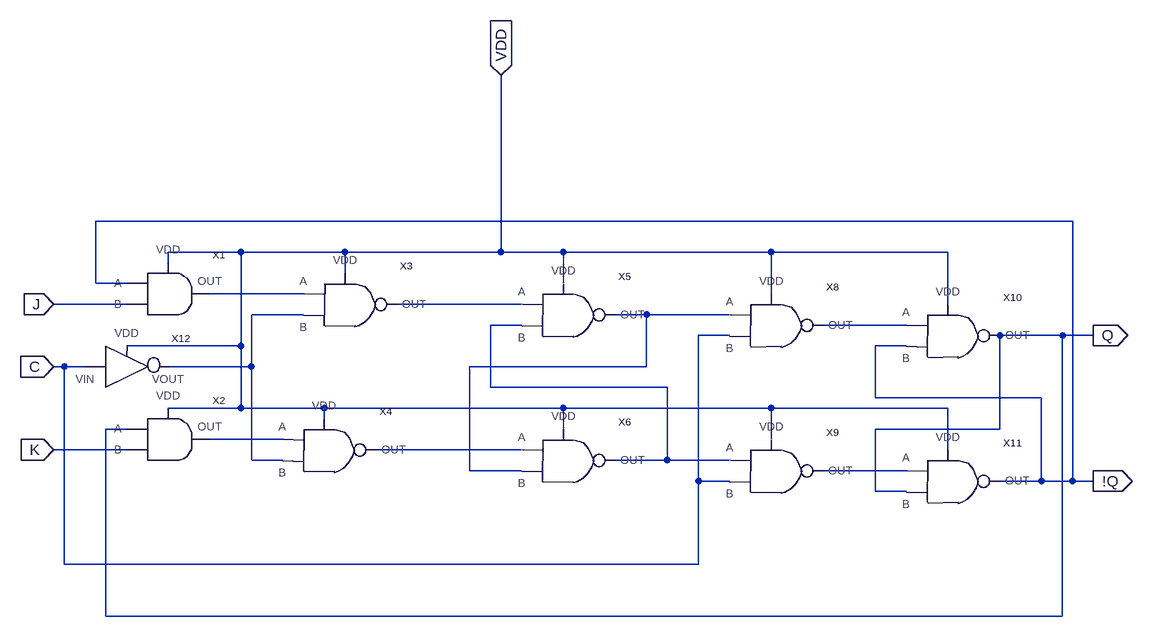
[diagram p0: schematic jk-front.asc]
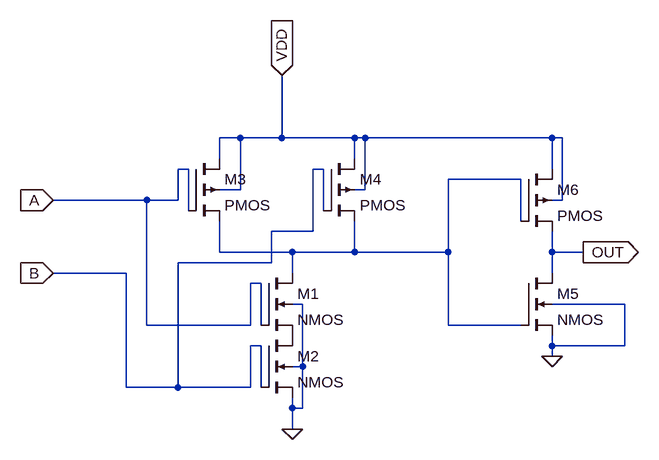
[diagram p1: sub-circuit and.asc]
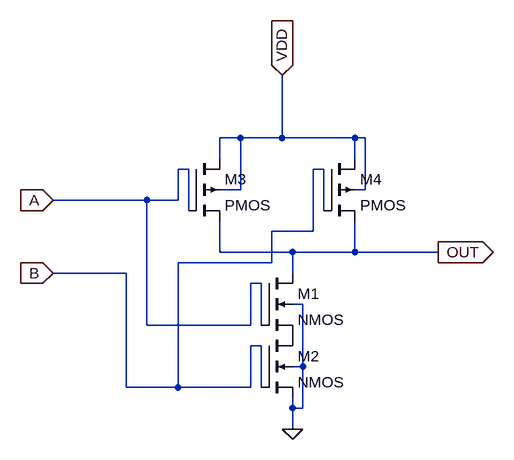
[diagram p2: sub-circuit nand.asc]
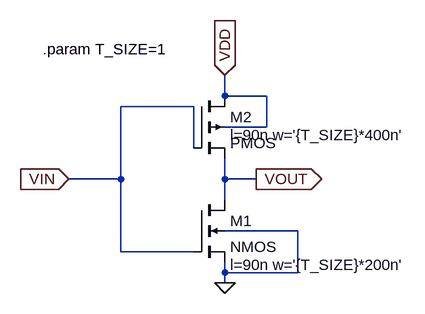
[diagram p3: sub-circuit inverter.asc]
jk-front.asc, the LTspice schematic file:
Version 4
SHEET 1 1588 680
WIRE 1472 -48 -32 -48
WIRE 192 0 80 0
WIRE 352 0 192 0
WIRE 592 0 592 -272
WIRE 592 0 352 0
WIRE 688 0 592 0
WIRE 1008 0 688 0
WIRE 1280 0 1008 0
WIRE 80 16 80 0
WIRE 352 32 352 0
WIRE -32 48 -32 -48
WIRE 16 48 -32 48
WIRE 688 48 688 0
WIRE 288 64 144 64
WIRE 1008 64 1008 0
WIRE 16 80 -96 80
WIRE 624 80 432 80
WIRE 1280 80 1280 0
WIRE 288 96 208 96
WIRE 816 96 768 96
WIRE 944 96 816 96
WIRE 624 112 576 112
WIRE 1216 112 1088 112
WIRE 944 128 896 128
WIRE 1456 128 1360 128
WIRE 1504 128 1456 128
WIRE 192 144 192 0
WIRE 192 144 16 144
WIRE 1216 144 1168 144
WIRE -80 176 -96 176
WIRE -48 176 -80 176
WIRE 208 176 208 96
WIRE 208 176 80 176
WIRE 816 176 816 96
WIRE 816 176 544 176
WIRE 576 208 576 112
WIRE 848 208 576 208
WIRE 1168 224 1168 144
WIRE 1424 224 1168 224
WIRE 192 240 192 144
WIRE 192 240 80 240
WIRE 320 240 192 240
WIRE 688 240 320 240
WIRE 1008 240 688 240
WIRE 1280 240 1008 240
WIRE 320 256 320 240
WIRE 16 272 -16 272
WIRE 688 272 688 240
WIRE 1360 272 1360 128
WIRE 1360 272 1168 272
WIRE 256 288 144 288
WIRE 1008 288 1008 240
WIRE 16 304 -96 304
WIRE 624 304 400 304
WIRE 1280 304 1280 240
WIRE 208 320 208 176
WIRE 256 320 208 320
WIRE 848 320 848 208
WIRE 848 320 768 320
WIRE 944 320 848 320
WIRE 544 336 544 176
WIRE 624 336 544 336
WIRE 1216 336 1088 336
WIRE 896 352 896 128
WIRE 944 352 896 352
WIRE 1424 352 1424 224
WIRE 1424 352 1360 352
WIRE 1472 352 1472 -48
WIRE 1472 352 1424 352
WIRE 1504 352 1472 352
WIRE 1168 368 1168 272
WIRE 1216 368 1168 368
WIRE -80 480 -80 176
WIRE 896 480 896 352
WIRE 896 480 -80 480
WIRE -16 560 -16 272
WIRE 1456 560 1456 128
WIRE 1456 560 -16 560
FLAG -96 80 J
IOPIN -96 80 In
FLAG -96 176 C
IOPIN -96 176 In
FLAG -96 304 K
IOPIN -96 304 In
FLAG 1504 128 Q
IOPIN 1504 128 Out
FLAG 1504 352 !Q
IOPIN 1504 352 Out
FLAG 592 -272 VDD
IOPIN 592 -272 In
SYMBOL and 64 64 R0
SYMATTR InstName X1
SYMBOL and 64 288 R0
SYMATTR InstName X2
SYMBOL nand 352 80 R0
SYMATTR InstName X3
SYMBOL nand 320 304 R0
SYMATTR InstName X4
SYMBOL nand 688 96 R0
SYMATTR InstName X5
SYMBOL nand 688 320 R0
SYMATTR InstName X6
SYMBOL nand 1008 112 R0
SYMATTR InstName X8
SYMBOL nand 1008 336 R0
SYMATTR InstName X9
SYMBOL nand 1280 128 R0
SYMATTR InstName X10
SYMBOL nand 1280 352 R0
SYMATTR InstName X11
SYMBOL inverter 16 176 R0
SYMATTR InstName X12

and.asc, the sub-circuit schematic file:
Version 4
SHEET 1 1116 788
WIRE 112 -32 80 -32
WIRE 176 -32 176 -128
WIRE 176 -32 112 -32
WIRE 288 -32 176 -32
WIRE 304 -32 288 -32
WIRE 592 -32 304 -32
WIRE 608 -32 592 -32
WIRE 80 0 80 -32
WIRE 288 0 288 -32
WIRE 32 16 16 16
WIRE 240 16 224 16
WIRE 592 16 592 -32
WIRE 544 32 432 32
WIRE 112 48 112 -32
WIRE 112 48 80 48
WIRE 304 48 304 -32
WIRE 304 48 288 48
WIRE -32 64 -176 64
WIRE 16 64 16 16
WIRE 16 64 -32 64
WIRE 608 64 608 -32
WIRE 608 64 592 64
WIRE 32 80 32 16
WIRE 240 80 240 16
WIRE 544 96 544 32
WIRE 224 112 224 16
WIRE 224 112 160 112
WIRE 80 144 80 96
WIRE 192 144 80 144
WIRE 288 144 288 96
WIRE 288 144 192 144
WIRE 432 144 432 32
WIRE 432 144 288 144
WIRE 592 144 592 112
WIRE 640 144 592 144
WIRE 160 160 160 112
WIRE 160 160 16 160
WIRE -64 176 -176 176
WIRE 192 176 192 144
WIRE 592 176 592 144
WIRE 144 192 128 192
WIRE 208 224 192 224
WIRE 704 224 592 224
WIRE -32 256 -32 64
WIRE 128 256 128 192
WIRE 128 256 -32 256
WIRE 144 256 144 192
WIRE 432 256 432 144
WIRE 544 256 432 256
WIRE 144 288 128 288
WIRE 592 288 592 272
WIRE 704 288 704 224
WIRE 704 288 592 288
WIRE 592 304 592 288
WIRE 208 320 208 224
WIRE 208 320 192 320
WIRE -64 352 -64 176
WIRE 16 352 16 160
WIRE 16 352 -64 352
WIRE 128 352 128 288
WIRE 128 352 16 352
WIRE 144 352 144 288
WIRE 192 384 192 368
WIRE 208 384 208 320
WIRE 208 384 192 384
WIRE 192 416 192 384
FLAG 192 416 0
FLAG -176 64 A
IOPIN -176 64 In
FLAG -176 176 B
IOPIN -176 176 In
FLAG 176 -128 VDD
IOPIN 176 -128 In
FLAG 592 304 0
FLAG 640 144 OUT
IOPIN 640 144 Out
SYMBOL nmos4 144 176 R0
SYMATTR InstName M1
SYMATTR Value2 l=90n w=200n
SYMBOL nmos4 144 272 R0
SYMATTR InstName M2
SYMATTR Value2 l=90n w=200n
SYMBOL pmos4 32 0 R0
SYMATTR InstName M3
SYMATTR Value2 l=90n w=400n
SYMBOL pmos4 240 0 R0
SYMATTR InstName M4
SYMATTR Value2 l=90n w=400n
SYMBOL nmos4 544 176 R0
SYMATTR Value2 l=90n w=200n
SYMATTR InstName M5
SYMBOL pmos4 544 16 R0
SYMATTR Value2 l=90n w=400n
SYMATTR InstName M6

nand.asc, the sub-circuit schematic file:
Version 4
SHEET 1 880 680
WIRE 144 -80 112 -80
WIRE 208 -80 208 -176
WIRE 208 -80 144 -80
WIRE 320 -80 208 -80
WIRE 336 -80 320 -80
WIRE 112 -48 112 -80
WIRE 320 -48 320 -80
WIRE 64 -32 48 -32
WIRE 272 -32 256 -32
WIRE 144 0 144 -80
WIRE 144 0 112 0
WIRE 336 0 336 -80
WIRE 336 0 320 0
WIRE 0 16 -144 16
WIRE 48 16 48 -32
WIRE 48 16 0 16
WIRE 64 32 64 -32
WIRE 272 32 272 -32
WIRE 256 64 256 -32
WIRE 256 64 192 64
WIRE 112 96 112 48
WIRE 224 96 112 96
WIRE 320 96 320 48
WIRE 320 96 224 96
WIRE 448 96 320 96
WIRE 192 112 192 64
WIRE 192 112 48 112
WIRE -32 128 -144 128
WIRE 224 128 224 96
WIRE 176 144 160 144
WIRE 240 176 224 176
WIRE 0 208 0 16
WIRE 160 208 160 144
WIRE 160 208 0 208
WIRE 176 208 176 144
WIRE 176 240 160 240
WIRE 240 272 240 176
WIRE 240 272 224 272
WIRE -32 304 -32 128
WIRE 48 304 48 112
WIRE 48 304 -32 304
WIRE 160 304 160 240
WIRE 160 304 48 304
WIRE 176 304 176 240
WIRE 224 336 224 320
WIRE 240 336 240 272
WIRE 240 336 224 336
WIRE 224 368 224 336
FLAG 224 368 0
FLAG 448 96 OUT
IOPIN 448 96 Out
FLAG -144 16 A
IOPIN -144 16 In
FLAG -144 128 B
IOPIN -144 128 In
FLAG 208 -176 VDD
IOPIN 208 -176 In
SYMBOL nmos4 176 128 R0
SYMATTR InstName M1
SYMATTR Value2 l=90n w=200n
SYMBOL nmos4 176 224 R0
SYMATTR InstName M2
SYMATTR Value2 l=90n w=200n
SYMBOL pmos4 64 -48 R0
SYMATTR InstName M3
SYMATTR Value2 l=90n w=400n
SYMBOL pmos4 272 -48 R0
SYMATTR InstName M4
SYMATTR Value2 l=90n w=400n

inverter.asc, the sub-circuit schematic file:
Version 4
SHEET 1 880 680
WIRE 176 -128 176 -160
WIRE 240 -128 176 -128
WIRE 128 -112 16 -112
WIRE 240 -80 240 -128
WIRE 240 -80 176 -80
WIRE 128 -48 128 -112
WIRE 16 0 16 -112
WIRE 16 0 -64 0
WIRE 176 0 176 -32
WIRE 224 0 176 0
WIRE 176 32 176 0
WIRE 288 80 176 80
WIRE 16 112 16 0
WIRE 128 112 16 112
WIRE 176 144 176 128
WIRE 288 144 288 80
WIRE 288 144 176 144
WIRE 176 160 176 144
FLAG 176 160 0
FLAG -64 0 VIN
IOPIN -64 0 In
FLAG 224 0 VOUT
IOPIN 224 0 Out
FLAG 176 -160 VDD
IOPIN 176 -160 In
SYMBOL nmos4 128 32 R0
WINDOW 123 56 100 Left 2
SYMATTR InstName M1
SYMATTR Value2 l=90n w='{T_SIZE}*200n'
SYMBOL pmos4 128 -128 R0
WINDOW 123 56 60 Left 2
SYMATTR InstName M2
SYMATTR Value2 l=90n w='{T_SIZE}*400n'
TEXT -104 -200 Left 2 !.param T_SIZE=1

The netlist it stands for:
* jk-front.asc
XX1 VDD !Q J N001 and
XX2 VDD Q K N007 and
XX3 N001 N003 N002 VDD nand
XX4 N007 N003 N008 VDD nand
XX5 N002 N005 N004 VDD nand
XX6 N008 N004 N005 VDD nand
XX8 N004 C N006 VDD nand
XX9 N005 C N009 VDD nand
XX10 N006 !Q Q VDD nand
XX11 N009 Q !Q VDD nand
XX12 C VDD N003 inverter

* block symbol definitions
.subckt and VDD A B OUT
M1 N001 A P001 0 NMOS l=90n w=200n
M2 P001 B 0 0 NMOS l=90n w=200n
M3 VDD A N001 VDD PMOS l=90n w=400n
M4 VDD B N001 VDD PMOS l=90n w=400n
M5 OUT N001 0 0 NMOS l=90n w=200n
M6 VDD N001 OUT VDD PMOS l=90n w=400n
.ends and

.subckt nand A B OUT VDD
M1 OUT A P001 0 NMOS l=90n w=200n
M2 P001 B 0 0 NMOS l=90n w=200n
M3 VDD A OUT VDD PMOS l=90n w=400n
M4 VDD B OUT VDD PMOS l=90n w=400n
.ends nand

.subckt inverter VIN VDD VOUT
M1 VOUT VIN 0 0 NMOS l=90n w='{T_SIZE}*200n'
M2 VDD VIN VOUT VDD PMOS l=90n w='{T_SIZE}*400n'
.param T_SIZE=1
.ends inverter

.model NMOS NMOS
.model PMOS PMOS
.lib standard.mos
.backanno
.end